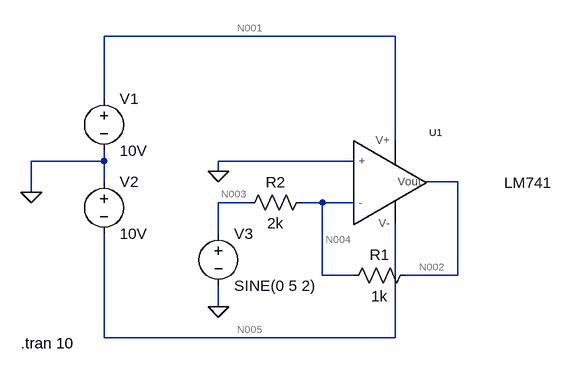
[diagram p0: schematic inverting amp.asc]
inverting amp.asc, the LTspice schematic file:
Version 4.1
SHEET 1 880 680
WIRE 240 -64 -208 -64
WIRE -208 32 -208 -64
WIRE 240 96 240 -64
WIRE -208 128 -208 112
WIRE -208 128 -320 128
WIRE 176 128 -32 128
WIRE -32 144 -32 128
WIRE -208 160 -208 128
WIRE 336 160 288 160
WIRE -320 176 -320 128
WIRE 16 192 -32 192
WIRE 128 192 96 192
WIRE 176 192 128 192
WIRE -32 240 -32 192
WIRE 128 304 128 192
WIRE 176 304 128 304
WIRE 336 304 336 160
WIRE 336 304 256 304
WIRE -32 352 -32 320
WIRE -208 400 -208 240
WIRE 240 400 240 224
WIRE 240 400 -208 400
FLAG -320 176 0
FLAG -32 352 0
FLAG -32 144 0
SYMBOL LM\ 741\\LM741 224 176 R0
WINDOW 3 221 -30 Top 2
SYMATTR InstName U1
SYMBOL voltage -208 16 R0
WINDOW 123 0 0 Left 0
WINDOW 39 0 0 Left 0
SYMATTR InstName V1
SYMATTR Value 10V
SYMBOL voltage -208 144 R0
WINDOW 123 0 0 Left 0
WINDOW 39 0 0 Left 0
SYMATTR InstName V2
SYMATTR Value 10V
SYMBOL res 272 288 R90
WINDOW 0 0 56 VBottom 2
WINDOW 3 32 56 VTop 2
SYMATTR InstName R1
SYMATTR Value 1k
SYMBOL res 112 176 R90
WINDOW 0 0 56 VBottom 2
WINDOW 3 32 56 VTop 2
SYMATTR InstName R2
SYMATTR Value 2k
SYMBOL voltage -32 224 R0
WINDOW 123 0 0 Left 0
WINDOW 39 0 0 Left 0
SYMATTR InstName V3
SYMATTR Value SINE(0 5 2)
TEXT -336 408 Left 2 !.tran 10

The netlist it stands for:
* inverting amp.asc
X§U1 0 N004 N001 N005 N002 LM741  ; pins + - V+ V- Vout
V1 N001 0 10V
V2 0 N005 10V
R1 N002 N004 1k
R2 N004 N003 2k
V3 N003 0 SINE(0 5 2)
.tran 10
.lib C:\Users\Subodha\Desktop\Desk\2nd Semester\Electronics\LT Spices\Unity gain amplifier\LM 741\lm741.lib
.backanno
.end

* Results of the author's LTspice run, read from the files saved beside the schematic
* Operating Point, zero values left out:
*   V(n001) = 10 V
*   V(n002) = 1.602 mV
*   V(n004) = 1 mV
*   V(n005) = -10 V
*   I(V1) = -1.576 mA
*   I(R2) = 500 nA
*   I(V2) = -1.576 mA
*   I(R1) = 601.9 nA
*   I(V3) = 500 nA
*   Ix(u1:1) = 57.86 nA
*   Ix(u1:2) = 101.9 nA
*   Ix(u1:99) = 1.576 mA
*   Ix(u1:50) = -1.576 mA
*   Ix(u1:28) = -601.9 nA
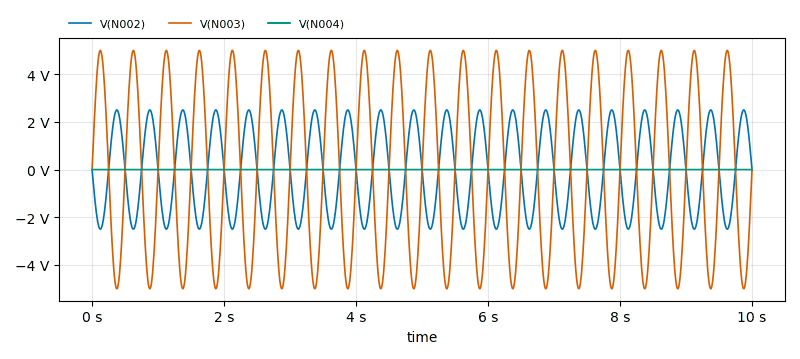
[diagram p1: Transient Analysis of inverting amp.asc, plotted from the saved traces]
* Transient Analysis, 1 run:
*   V(N002): min -2.498 V, max 2.502 V, average 1.602 mV, rms 1.768 V, last 1.61 mV
*   V(N003): min -5 V, max 5 V, average 0 V, rms 3.536 V, last 0 V
*   V(N004): min 985.4 µV, max 1.015 mV, average 1 mV, rms 1 mV, last 1.006 mV